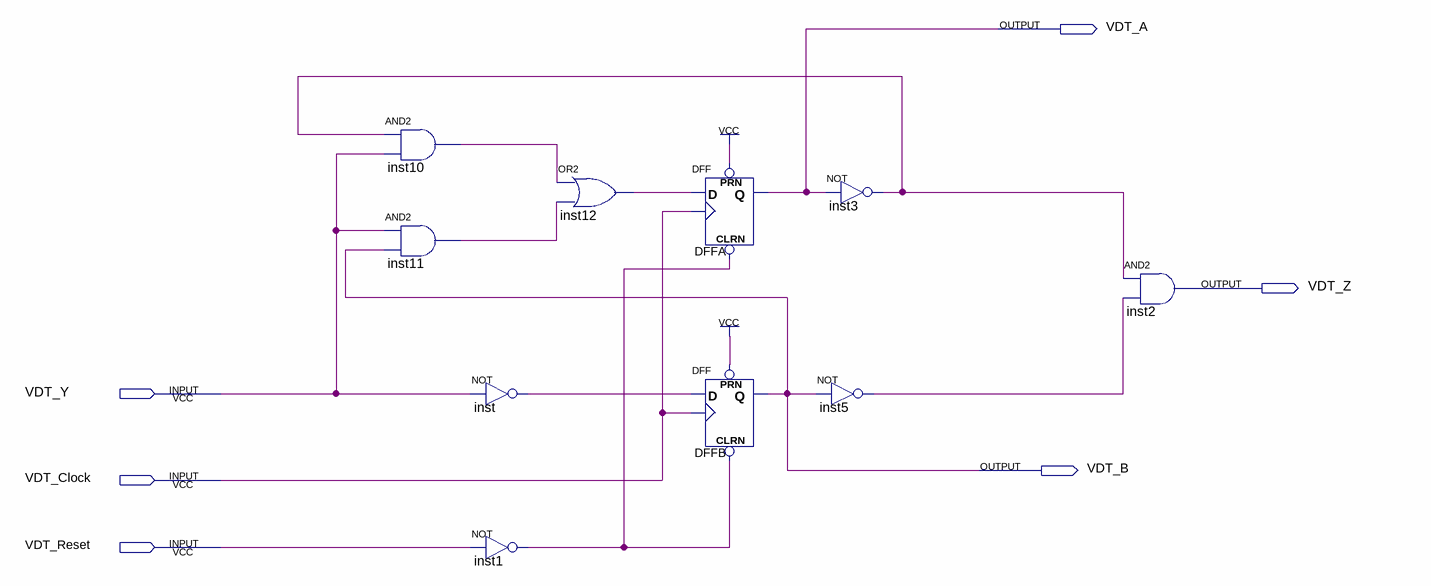
[diagram p0: schematic sheet]
// Quartus schematic assignment1.bdf as structural Verilog: 10 symbols, 6 pins
module assignment1 (
  input  VDT_Y,
  input  VDT_Clock,
  input  VDT_Reset,
  output VDT_A,
  output VDT_Z,
  output VDT_B
);

  wire inst1_out, inst3_out, inst5_out, inst10_out, inst11_out, inst12_out, inst_out;

  and inst10 (inst10_out, inst3_out, VDT_Y);
  and inst11 (inst11_out, VDT_Y, VDT_B);
  not inst (inst_out, VDT_Y);
  not inst1 (inst1_out, VDT_Reset);
  or inst12 (inst12_out, inst10_out, inst11_out);
  DFF DFFA (.CLRN(inst1_out), .CLK(VDT_Clock), .D(inst12_out), .PRN(1'b1), .Q(VDT_A));
  DFF DFFB (.CLRN(inst1_out), .CLK(VDT_Clock), .D(inst_out), .PRN(1'b1), .Q(VDT_B));
  not inst3 (inst3_out, VDT_A);
  not inst5 (inst5_out, VDT_B);
  and inst2 (VDT_Z, inst3_out, inst5_out);
endmodule
